# Altium schematic sheet ERN_Main_4.SchDoc
size A; SheetNumber: 4; SheetTotal: 4; SPICEModelCacheELVNKBHK: <root> / <DocumentId>ELVNKBHK</DocumentId> / <CacheFrame Number="0"> / <Model Name="led2" Kind="MDL"> / <Text>*Typ RED,GREEN,YELLOW,AMBER GaAs LED: Vf=2.1V Vr=4V If=40mA trr=3uS / *LED Pinout: 1=A, 2=K / .MODEL LED2 D (IS=93.1P RS=42M N=4.61 BV=4 IBV=10U / + CJO=2.97P VJ=.75 M=.333 TT=4.32U)</Text> / </Model> / <Model Name="1n5400" Kind="MDL"> / <Text>*1N5400 MCE / * 50V 3A Si Rectifier pkg:DO-201 1,2 / .MODEL 1N5400 D(IS=2.68E-12 RS=0.00977 N=1.17 TT=1.44E-5 CJO=1.24E-10 / + VJ=0.6 M=0.333 BV=66.6 IBV=1E-5 )</Text> / </Model> / </CacheFrame> / </root>
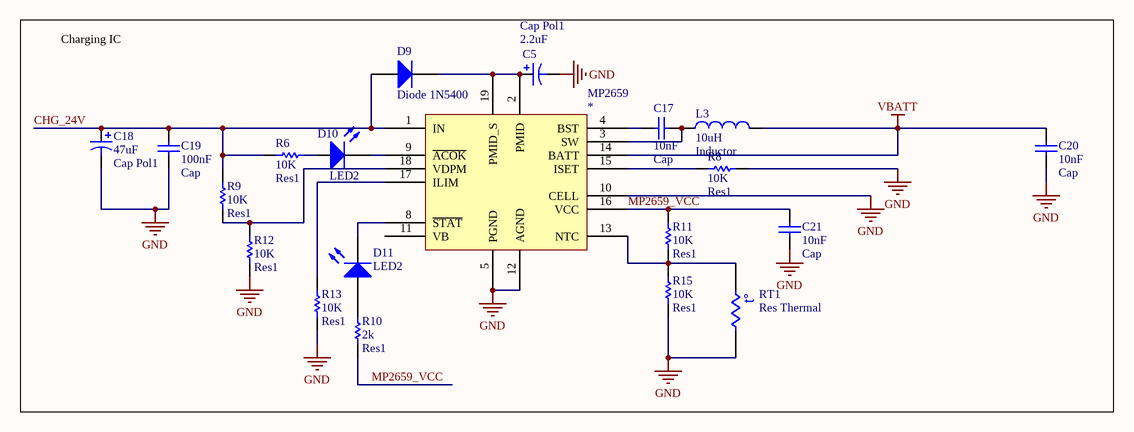
[diagram p0: ERN_Main_4.SchDoc]

## Parts
*  MP2659
C5  Cap Pol1  value 2.2uF  [RB7.6-15]
C17  Cap  value 10nF  [RAD-0.3]
C18  Cap Pol1  value 47uF  [RB7.6-15]
C19  Cap  value 100nF  [RAD-0.3]
C20  Cap  value 10nF  [RAD-0.3]
C21  Cap  value 10nF  [RAD-0.3]
D9  Diode 1N5400  [DO-201AD]
D10  LED2  [3.2X1.6X1.1]
D11  LED2  [3.2X1.6X1.1]
L3  Inductor  value 10uH  [0402-A]
R6  Res1  value 10K  [AXIAL-0.3]
R8  Res1  value 10K  [AXIAL-0.3]
R9  Res1  value 10K  [AXIAL-0.3]
R10  Res1  value 2k  [AXIAL-0.3]
R11  Res1  value 10K  [AXIAL-0.3]
R12  Res1  value 10K  [AXIAL-0.3]
R13  Res1  value 10K  [AXIAL-0.3]
R15  Res1  value 10K  [AXIAL-0.3]
RT1  Res Thermal  [6-0805_N]

## Blocks framed on the sheet
Charging IC: * C5 C17-C21 D9-D11 L3 R6 R8-R13 R15 RT1

## Nets
GND: *.5(PGND) *.10(CELL) *.12(AGND) C5.2 C18.2 C19.1 C20.2 C21.2 R8.2 R12.2 R13.2 R15.1 RT1.2
VBATT: *.14(BATT) C20.1 L3.2
CHG_24V: *.1(IN) C18.1 C19.2 D9.1(A) R6.2 R9.1
MP2659_VCC: *.16(VCC) C21.1 R10.2 R11.2
Net*_2: *.2(PMID) *.19(PMID_S) C5.1 D9.2(K)
Net*_3: *.3(SW) C17.1 L3.1
Net*_4: *.4(BST) C17.2
Net*_8: *.8(~{STAT}) D11.2(K)
Net*_9: *.9(~{ACOK}) D10.2(K)
Net*_13: *.13(NTC) R11.1 R15.2 RT1.1
Net*_15: *.15(ISET) R8.1
Net*_17: *.17(ILIM) R13.1
Net*_18: *.18(VDPM) R9.2 R12.1
NetD10_1: D10.1(A) R6.1
NetD11_1: D11.1(A) R10.1

Not connected (* = marked no-connect by the designer): * 11(VB)

## Notes on the sheet
- (in symbol Res Thermal) t°

## Library data of the parts
* = MP2659: 3S-6S Standalone Switching Charger
C5 C18 = Cap Pol1: Polarized Capacitor (Radial); Published: 8-Jun-2000; LatestRevisionDate: 17-Jul-2002; LatestRevisionNote: Re-released for DXP Platform.; PackageReference: RB7.6-15; Publisher: Altium Limited; PackageDescription: Polarized Capacitor (Radial); 2 Leads
C17 C19-C21 = Cap: Capacitor; Published: 8-Jun-2000; LatestRevisionDate: 17-Jul-2002; LatestRevisionNote: Re-released for DXP Platform.; PackageReference: RAD-0.3; Publisher: Altium Limited; PackageDescription: Radial Cap, Thru-Hole; 2 Leads; 0.3 in Pin Spacing
D9 = Diode 1N5400: 3 Amp General Purpose Rectifier; Published: 8-Jun-2000; LatestRevisionDate: 17-Jul-2002; LatestRevisionNote: Re-released for DXP Platform.; DatasheetVersion: 1998; PackageVersion: Aug-1999; PackageReference: DO-201AD; Publisher: Altium Limited; PackageDescription: Diode, Axial; Body 9.5 x 5.6 mm (LxDia. max), Lead Dia. 1.32 mm (max); ComponentLink1Description: Manufacturer Link; ComponentLink1URL: http://www.fairchildsemi.com/; ComponentLink2Description: Datasheet; ComponentLink2URL: http://www.fairchildsemi.com/ds/1N%2F1N5400.pdf
D10 D11 = LED2: Typical RED, GREEN, YELLOW, AMBER GaAs LED; Published: 8-Jun-2000; LatestRevisionDate: 17-Jul-2002; LatestRevisionNote: Re-released for DXP Platform.; PackageVersion: Feb-2002; PackageReference: 3.2X1.6X1.1; Publisher: Altium Limited; PackageDescription: SM LED; 2 Flat Leads
L3 = Inductor: Code_IEC: 1005; Published: 8-Jun-2000; LatestRevisionDate: 29-May-2009; LatestRevisionNote: IPC-7351 Footprint Added.; PackageReference: 0402-A; Publisher: Altium Limited; PackageDescription: Chip Inductor; Code_JEITA: 0402
R6 R8-R13 R15 = Res1: Resistor; Published: 8-Jun-2000; LatestRevisionDate: 17-Jul-2002; LatestRevisionNote: Re-released for DXP Platform.; PackageReference: AXIAL-0.3; Publisher: Altium Limited; PackageDescription: Axial Device, Thru-Hole; 2 Leads; 0.3 in Pin Spacing
RT1 = Res Thermal: Thermistor; Published: 24-Mar-1999; LatestRevisionDate: 29-May-2009; LatestRevisionNote: IPC-7351 Footprint Added.; PackageVersion: Mar-2003; PackageReference: 6-0805; Publisher: Altium Limited; PackageDescription: Chip Resistor 0805 Case Size; Code_IPC: RESC2012